# Altium schematic sheet MX1508.SchDoc
size A4; SheetNumber: 2; SheetTotal: 2
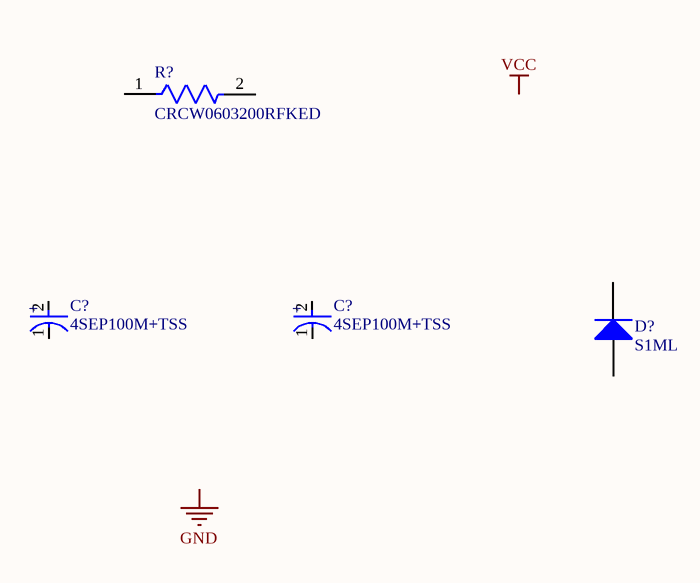
[diagram p0: MX1508.SchDoc]

## Parts
(Parts that share a designator on the sheet are numbered #1, #2 ... from top to bottom, then left to right.)
C?#1  4SEP100M+TSS  [FP-OS-CON-TH-C6-d_0_45-MFG]
C?#2  4SEP100M+TSS  [FP-OS-CON-TH-C6-d_0_45-MFG]
D?  S1ML  [TWS-S1ML_V]
R?  CRCW0603200RFKED  [FP-CRCW0603-e3-MFG]

## Nets

Not connected (* = marked no-connect by the designer): C?#1 1(C) 2(A); C?#2 1(C) 2(A); D? 1(A) 2(K); R? 1 2

## Notes on the sheet
- Labels drawn without touching a wire or pin: GND, VCC
- (in symbol CMP-05428-000141-1) +

## Library data of the parts
C?#1 C?#2 = CMP-05428-000141-1: Conductive Polymer Aluminum Solid Capacitors (OS-CON) 100uF ±20% 4V RADIAL TH 6.3x6mm; Lead Diameter: 0.45mm; Leakage Current: 200uA; Dissipation Factor: 12%; Polarity: Polar; Ripple Current: 1.81A; ESR (Equivalent Series Resistance): 40mR; Life (Hours): 3000Hour; Min Operating Temperature: -55°C; Lead Free: Lead Free; Package Quantity: 1500; Case/Package: Radial; Max Operating Temperature: 105°C; Mount: Through Hole; Tolerance: 20%; Diameter: 6.3mm; Termination: Radial; Length: 6mm; Voltage: 4V; Packaging: Tape and Reel; Voltage Rating (DC): 4V; RoHS Compliant: Yes; Lead Pitch: 2.5mm; Construction: RADIAL; Series: OS-CON, SEP; Voltage Rating: 4V; Height - Seated (Max): 0.236inch; Capacitance: 100uF
D? = CMP-2000-07014-1: Rectifier, 1 A, 1.1 V, -55 to 175 degC, 2-Pin SMD, RoHS, Tape and Reel; Manufacturer: Taiwan Semiconductor; Forward Current If(AV): 1A; Forward Voltage VF Max: 1.1V; Diode Configuration: Single; Reverse Recovery Time trr Max: 1.8µs; Forward Surge Current Ifsm Max: 30A; SVHC: NoSVHC(15-Jun-2015); Repetitive Reverse Voltage Vrrm Max: 1kV; No. of Pins: 2Pin; Mounting Technology: SurfaceMount; Package Reference: S1ML; Datasheet URL: http://www.taiwansemi.com/products/datasheet/S1AL%20SERIES_O15.pdf; Manufacturer URL: http://www.taiwansemi.com/; Package Description: 2-Pin Surface Mount Device, Body 2.8 x 1.8 mm; Product Range: -; Diode Case Style: SMD; Datasheet Version: Rev. O15, 05/2015; Packaging: CutTape; Operating Temperature Max: 150°C
R? = CMP-02407-009572-1: RES Thick Film, 200Ω, 1%, 0.1W, 100ppm/°C, 0603; Resistance: 200R; Max Power Dissipation: 100mW; Tolerance: 1%; Length: 0.061inch; Packaging: Tape and Reel; Features: Automotive AEC-Q200; Height: 0.02inch; Width: 0.033inch; Max Operating Temperature: 155°C; Min Operating Temperature: -55°C; Case/Package: 0603; Package Quantity: 10000; Temperature Coefficient: 100ppm/°C; Lead Free: Lead Free; Composition: Thick Film; Number of Terminations: 2